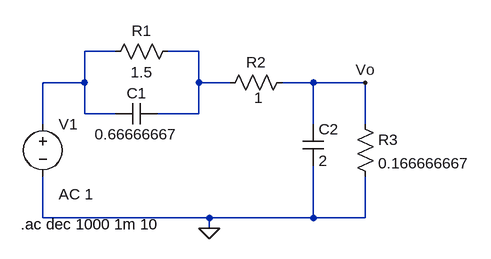
[diagram p0: schematic Circuito_Z.asc]
Circuito_Z.asc, the LTspice schematic file:
Version 4
SHEET 1 880 680
WIRE 80 112 32 112
WIRE 208 112 160 112
WIRE 32 160 32 112
WIRE 32 160 -32 160
WIRE 208 160 208 112
WIRE 256 160 208 160
WIRE 384 160 336 160
WIRE 464 160 384 160
WIRE 32 208 32 160
WIRE 80 208 32 208
WIRE 208 208 208 160
WIRE 208 208 144 208
WIRE -32 224 -32 160
WIRE 384 224 384 160
WIRE 464 224 464 160
WIRE -32 368 -32 304
WIRE 224 368 -32 368
WIRE 384 368 384 288
WIRE 384 368 224 368
WIRE 464 368 464 304
WIRE 464 368 384 368
WIRE 224 384 224 368
FLAG 224 384 0
FLAG 464 160 Vo
SYMBOL res 352 144 R90
WINDOW 0 0 56 VBottom 2
WINDOW 3 55 52 VBottom 2
SYMATTR InstName R2
SYMATTR Value 1
SYMBOL voltage -32 208 R0
WINDOW 123 24 124 Left 2
WINDOW 39 0 0 Left 0
SYMATTR InstName V1
SYMATTR Value ""
SYMATTR Value2 AC 1
SYMBOL res 448 208 R0
SYMATTR InstName R3
SYMATTR Value 0.166666667
SYMBOL cap 368 224 R0
SYMATTR InstName C2
SYMATTR Value 2
SYMBOL cap 144 192 R90
WINDOW 0 0 32 VBottom 2
WINDOW 3 32 32 VTop 2
SYMATTR InstName C1
SYMATTR Value 0.66666667
SYMBOL res 176 96 R90
WINDOW 0 0 56 VBottom 2
WINDOW 3 32 56 VTop 2
SYMATTR InstName R1
SYMATTR Value 1.5
TEXT -66 378 Left 2 !.ac dec 1000 1m 10

The netlist it stands for:
* Circuito_Z.asc
R2 Vo N002 1
V1 N001 0 AC 1
R3 Vo 0 0.166666667
C2 Vo 0 2
C1 N002 N001 0.66666667
R1 N002 N001 1.5
.ac dec 1000 1m 10
.backanno
.end